# EAGLE design ratsnest (EAGLE 6.5.0)
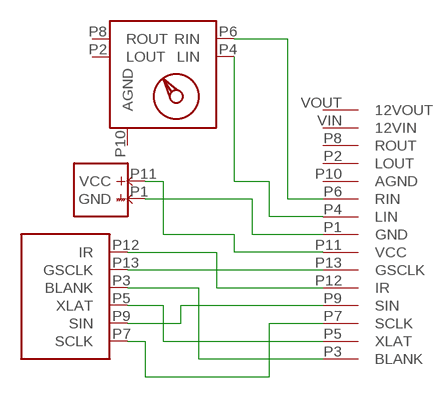
[diagram p0: schematic, sheet 1]

## Parts
U$9  OTHERSIDE  [OTHERSIDE]
U$16  CONNECTORSMALL4  [SMALLL4]

## Nets
N$1: U$9.P13(GSCLK) U$16.P13(GSCLK)
N$2: U$9.P12(IR) U$16.P12(IR)
N$3: U$9.P3(BLANK) U$16.P3(BLANK)
N$4: U$9.P5(XLAT) U$16.P5(XLAT)
N$5: U$9.P9(SIN) U$16.P9(SIN)
N$6: U$9.P7(SCLK) U$16.P7(SCLK)
N$7: U$9.P1(GND) U$16.P1(GND)
N$8: U$9.P11(VCC) U$16.P11(VCC)
N$9: U$9.P4(LIN) U$16.P4(LIN)
N$10: U$9.P6(RIN) U$16.P6(RIN)
Unconnected: U$9.P2(LOUT) U$9.P8(ROUT) U$9.P10(AGND) U$16.P2(LOUT) U$16.P8(ROUT) U$16.P10(AGND) U$16.VIN(12VIN) U$16.VOUT(12VOUT)

## Library data of the parts
U$9 = connector:OTHERSIDE
U$16 = connector:CONNECTOR

## Board
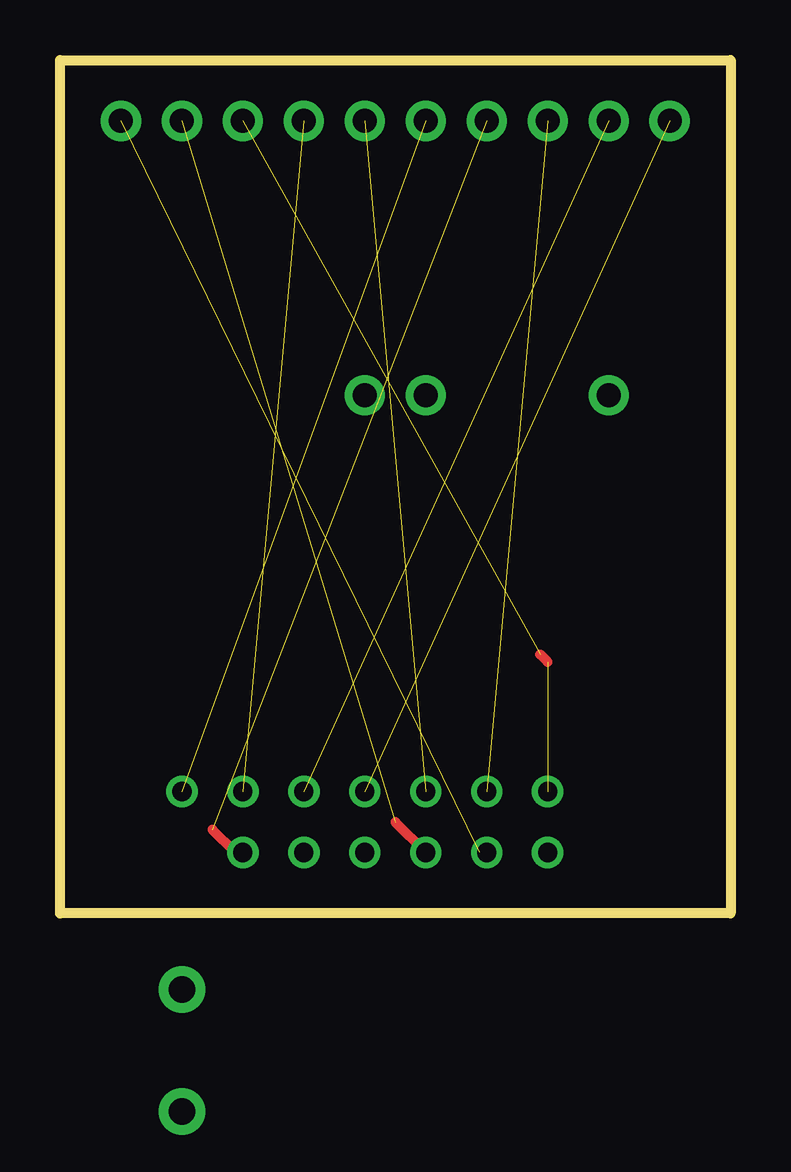
[diagram p1: board, top side]

Size 27.94 x 35.56 mm. Coordinates in mm from the lower left corner, seen from the top.
Outline: 0,35.56 27.94,35.56 27.94,0 0,0 0,35.56
Copper layers (1*16): Top 0.035mm / dielectric 1.5mm / Bottom 0.035mm
Design rules "default": minimum track width 10mil, minimum drill 24mil, track to track 8mil, track to pad 8mil, pad to pad 8mil, via to via 8mil, smd to smd 8mil, copper to edge 40mil, drill to drill 8mil, minimum pad ring 10mil, minimum via ring 8mil, stop-mask expansion 4mil, vias tented up to drill 0mil, thermal gap 10mil

### Footprints (pad centres in the part's own frame; a part is rotated, then mirrored left to right if it is on the bottom)
OTHERSIDE = drill 1 pad 1.676: P1 -13.97,10.16; P2 1.27,-1.27; P3 -1.27,10.16; P4 -19.05,10.16; P5 -8.89,10.16; P6 -16.51,10.16; P7 3.81,10.16; P8 -6.35,-1.27; P9 1.27,10.16; P10 -8.89,-1.27; P11 -11.43,10.16; P12 -3.81,10.16; P13 -6.35,10.16
SMALLL4 = drill 0.8: P1 1.27,1.27; P2 1.27,-1.27; P3 -1.27,1.27; P4 -1.27,-1.27; P5 -3.81,1.27; P6 -3.81,-1.27; P7 -6.35,1.27; P8 -6.35,-1.27; P9 -8.89,1.27; P10 -8.89,-1.27; P11 -11.43,1.27; P12 -11.43,-1.27; P13 -13.97,1.27 | drill 1.1 pad 1.93: VIN -13.97,-12.065; VOUT -13.97,-6.985

### Placement (x,y rotation side)
U$9  21.59,22.86 0 top
U$16  19.05,3.81 0 top

### Tracks (layer width: path | path; a pad name or v marks a point on that pad's centre or on a via)
N$1  (1 unrouted)
N$2  (1 unrouted)
  Top 0.406: U$16.P12 7.3,2.54 6.35,3.49
N$3  (1 unrouted)
N$4  (1 unrouted)
N$5  (1 unrouted)
N$6  (1 unrouted)
N$7  (2 unrouted)
  Top 0.406: 20.32,10.48 20,10.79
N$8  (1 unrouted)
N$9  (1 unrouted)
  Top 0.406: U$16.P4 17.46,2.54
N$10  (1 unrouted)
  Top 0.406: U$16.P6 13.97,3.81